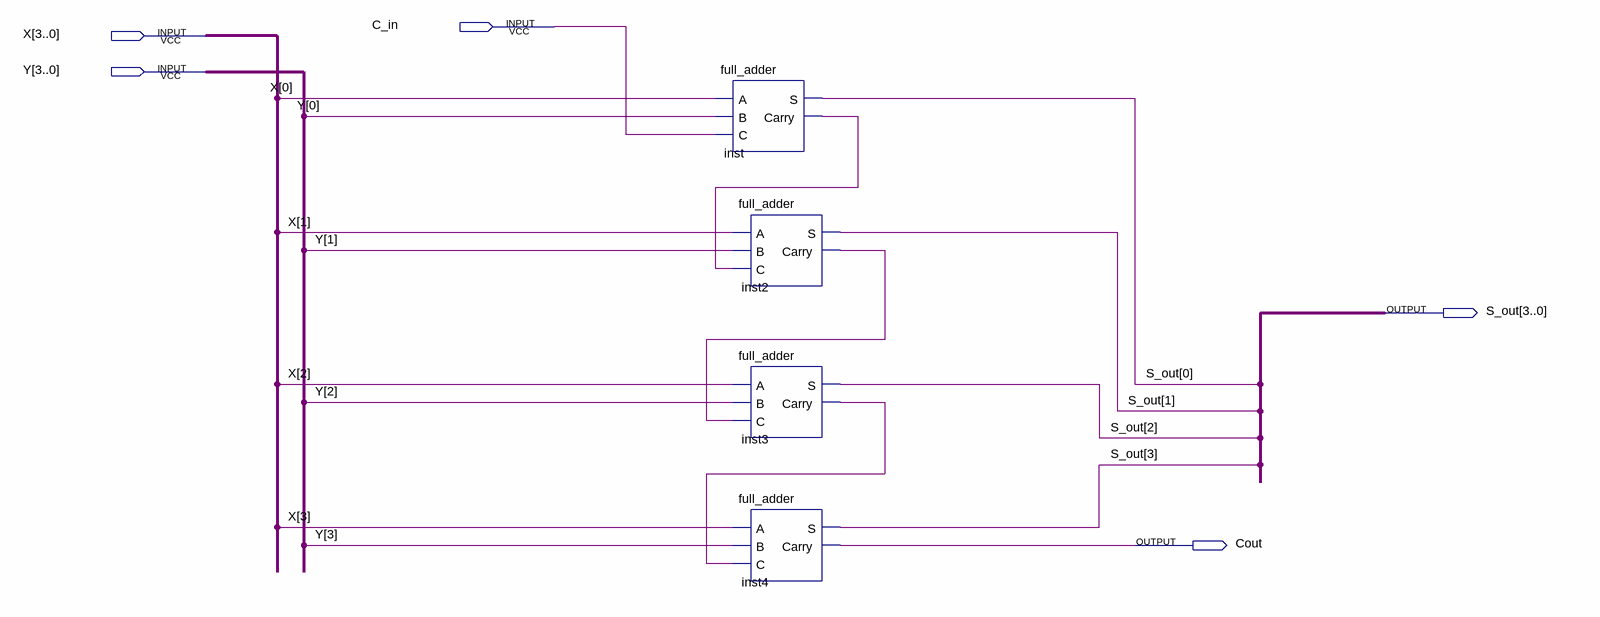
[diagram p0: schematic sheet]
// Quartus schematic ripple_carry_adder.bdf as structural Verilog: 4 symbols, 5 pins
module ripple_carry_adder (
  input  C_in,
  input  [3:0] X,
  input  [3:0] Y,
  output [3:0] S_out,
  output Cout
);

  wire inst2_carry, inst3_carry, inst_carry;

  full_adder inst (.A(X[0]), .B(Y[0]), .C(C_in), .S(S_out[0]), .Carry(inst_carry));
  full_adder inst2 (.A(X[1]), .B(Y[1]), .C(inst_carry), .S(S_out[1]), .Carry(inst2_carry));
  full_adder inst3 (.A(X[2]), .B(Y[2]), .C(inst2_carry), .S(S_out[2]), .Carry(inst3_carry));
  full_adder inst4 (.A(X[3]), .B(Y[3]), .C(inst3_carry), .S(S_out[3]), .Carry(Cout));
endmodule
